# Altium schematic sheet 1_TOP.SchDoc: AlarmBJT - Top level
size B; Author: Sébastien Gélinas; Organization: SmartHalo; Address1: 5445 de Gaspé; Address2: Montréal, QC; Address3: Canada; Address4: H2T 3B2; DocumentNumber: 1; Revision: 1; SheetNumber: 1; SheetTotal: 2
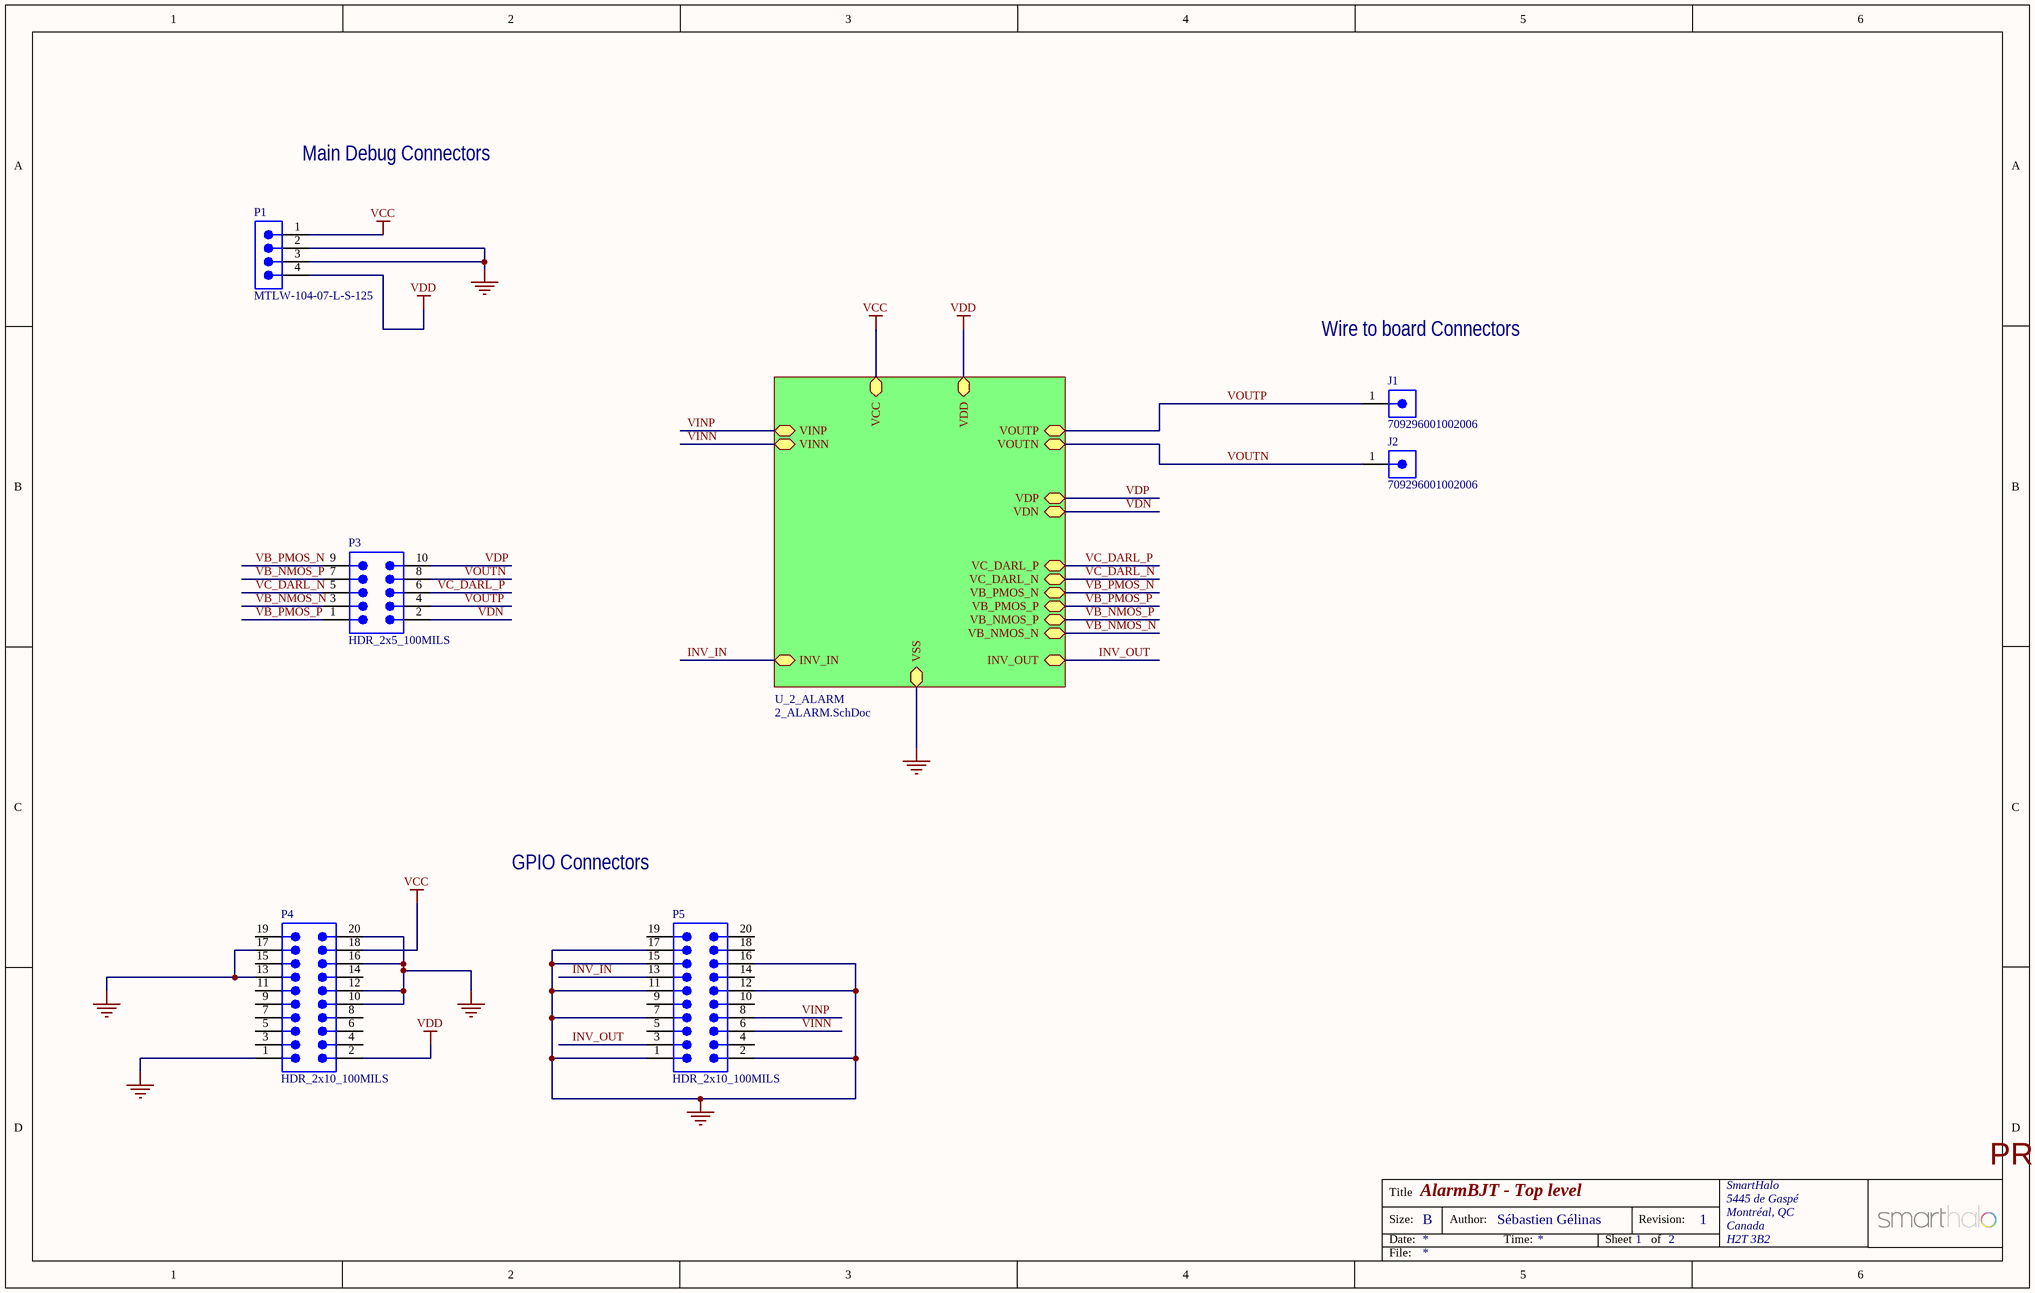
[diagram p0: 1_TOP.SchDoc]

## Parts
J1  709296001002006  [709296001002006]
J2  709296001002006  [709296001002006]
P1  MTLW-104-07-L-S-125  [SMTC-MTLW-104-07-X-S-125]  (no BOM)
P3  HDR_2x5_100MILS  [HDR_2X5_100MILS]  (no BOM)
P4  HDR_2x10_100MILS  [HDR_2X10_100MILS]  (no BOM)
P5  HDR_2x10_100MILS  [HDR_2X10_100MILS]  (no BOM)

## Sub-sheets
U_2_ALARM = 2_ALARM.SchDoc: VDD (bidir), VDP (bidir), VDN (bidir), VC_DARL_P (bidir), VC_DARL_N (bidir), VOUTN (bidir), VOUTP (bidir), VB_PMOS_N (bidir), VB_PMOS_P (bidir), VB_NMOS_P (bidir), VB_NMOS_N (bidir), VINP (bidir), VINN (bidir), VCC (bidir), INV_IN (bidir), INV_OUT (bidir), VSS (bidir)

## Nets
GND: P1.2 P1.3 P4.1 P4.10 P4.12 P4.13 P4.16 P4.17 P4.20 P5.1 P5.2 P5.7 P5.11 P5.12 P5.15 P5.16 P5.17 ; sheet U_2_ALARM/VSS
VCC: P1.1 P4.18 ; sheet U_2_ALARM/VCC
VDD: P1.4 P4.2 ; sheet U_2_ALARM/VDD
INV_IN: P5.13 ; sheet U_2_ALARM/INV_IN
INV_OUT: P5.3 ; sheet U_2_ALARM/INV_OUT
VB_NMOS_N: P3.3 ; sheet U_2_ALARM/VB_NMOS_N
VB_NMOS_P: P3.7 ; sheet U_2_ALARM/VB_NMOS_P
VB_PMOS_N: P3.9 ; sheet U_2_ALARM/VB_PMOS_N
VB_PMOS_P: P3.1 ; sheet U_2_ALARM/VB_PMOS_P
VC_DARL_N: P3.5 ; sheet U_2_ALARM/VC_DARL_N
VC_DARL_P: P3.6 ; sheet U_2_ALARM/VC_DARL_P
VDN: P3.2 ; sheet U_2_ALARM/VDN
VDP: P3.10 ; sheet U_2_ALARM/VDP
VINN: P5.6 ; sheet U_2_ALARM/VINN
VINP: P5.8 ; sheet U_2_ALARM/VINP
VOUTN: J2.1 P3.8 ; sheet U_2_ALARM/VOUTN
VOUTP: J1.1 P3.4 ; sheet U_2_ALARM/VOUTP

Not connected (* = marked no-connect by the designer): P4 3 4 5 6 7 8 9 11 14 15 19; P5 4 5 9 10 14 18 19 20

## Notes on the sheet
- Main Debug Connectors
- Wire to board Connectors
- GPIO Connectors
- PRELIMINARY: DO NOT USE FOR PRODUCTION
- Title
- Size:
- Date:
- B
- Author:
- Time:
- Sheet
- Revision:
- of
- File:

## Library data of the parts
J1 J2 = 709296001002006: Connector, Single Horizontal Contact, 2 x 2 mm; Manufacturer: AVX; Manufacturer Part Number: 709296001002006; Part Number: 709296001002006; Supplier: Arrow Electronics; Footprint Name: CUSTOM(Wire to board connector); Supplier Part Number: *
P1 = SMTC-MTLW-104-07-X-S-125: Low Profile .025" SQ Post Header, Through-hole, Vertical, -55 to 125 degC, 2.54 mm Pitch, 4-Pin, Male, RoHS; Manufacturer: Samtec; Pitch: 2.54 mm; PackageDescription: Low Profile Terminal Assembly; PartNumber: MTLW-104-07-L-S-125; PackageReference: MTLW-104-07-X-S-125; ComponentLink1Description: Manufacturer URL; ComponentLink2Description: Datasheet; ComponentLink2URL: http://www.samtec.com/documents/webfiles/pdf/MTLW_TH.PDF; ComponentLink3Description: Package Specification; Mounting Technology: Through-hole; ComponentLink3URL: http://www.samtec.com/documents/webfiles/cpdf/MTLW-1XX-XX-XX-X-XXX-XX-XX-MKT1.pdf; ComponentLink1URL: http://www.samtec.com; Orientation: Vertical; PackageVersion: T, 6/1991; DatasheetVersion: F-214; Temperature Range: -55 to 125 degC; RoHS: True
P3 = HDR_2x5_100MILS: Header, 100 mils, 2 rows, 10 pins
P4 P5 = HDR_2x10_100MILS: Header, 100 mils, 2 rows, 20 pins